# EAGLE design Main_module_v2 (EAGLE 9.1.1)
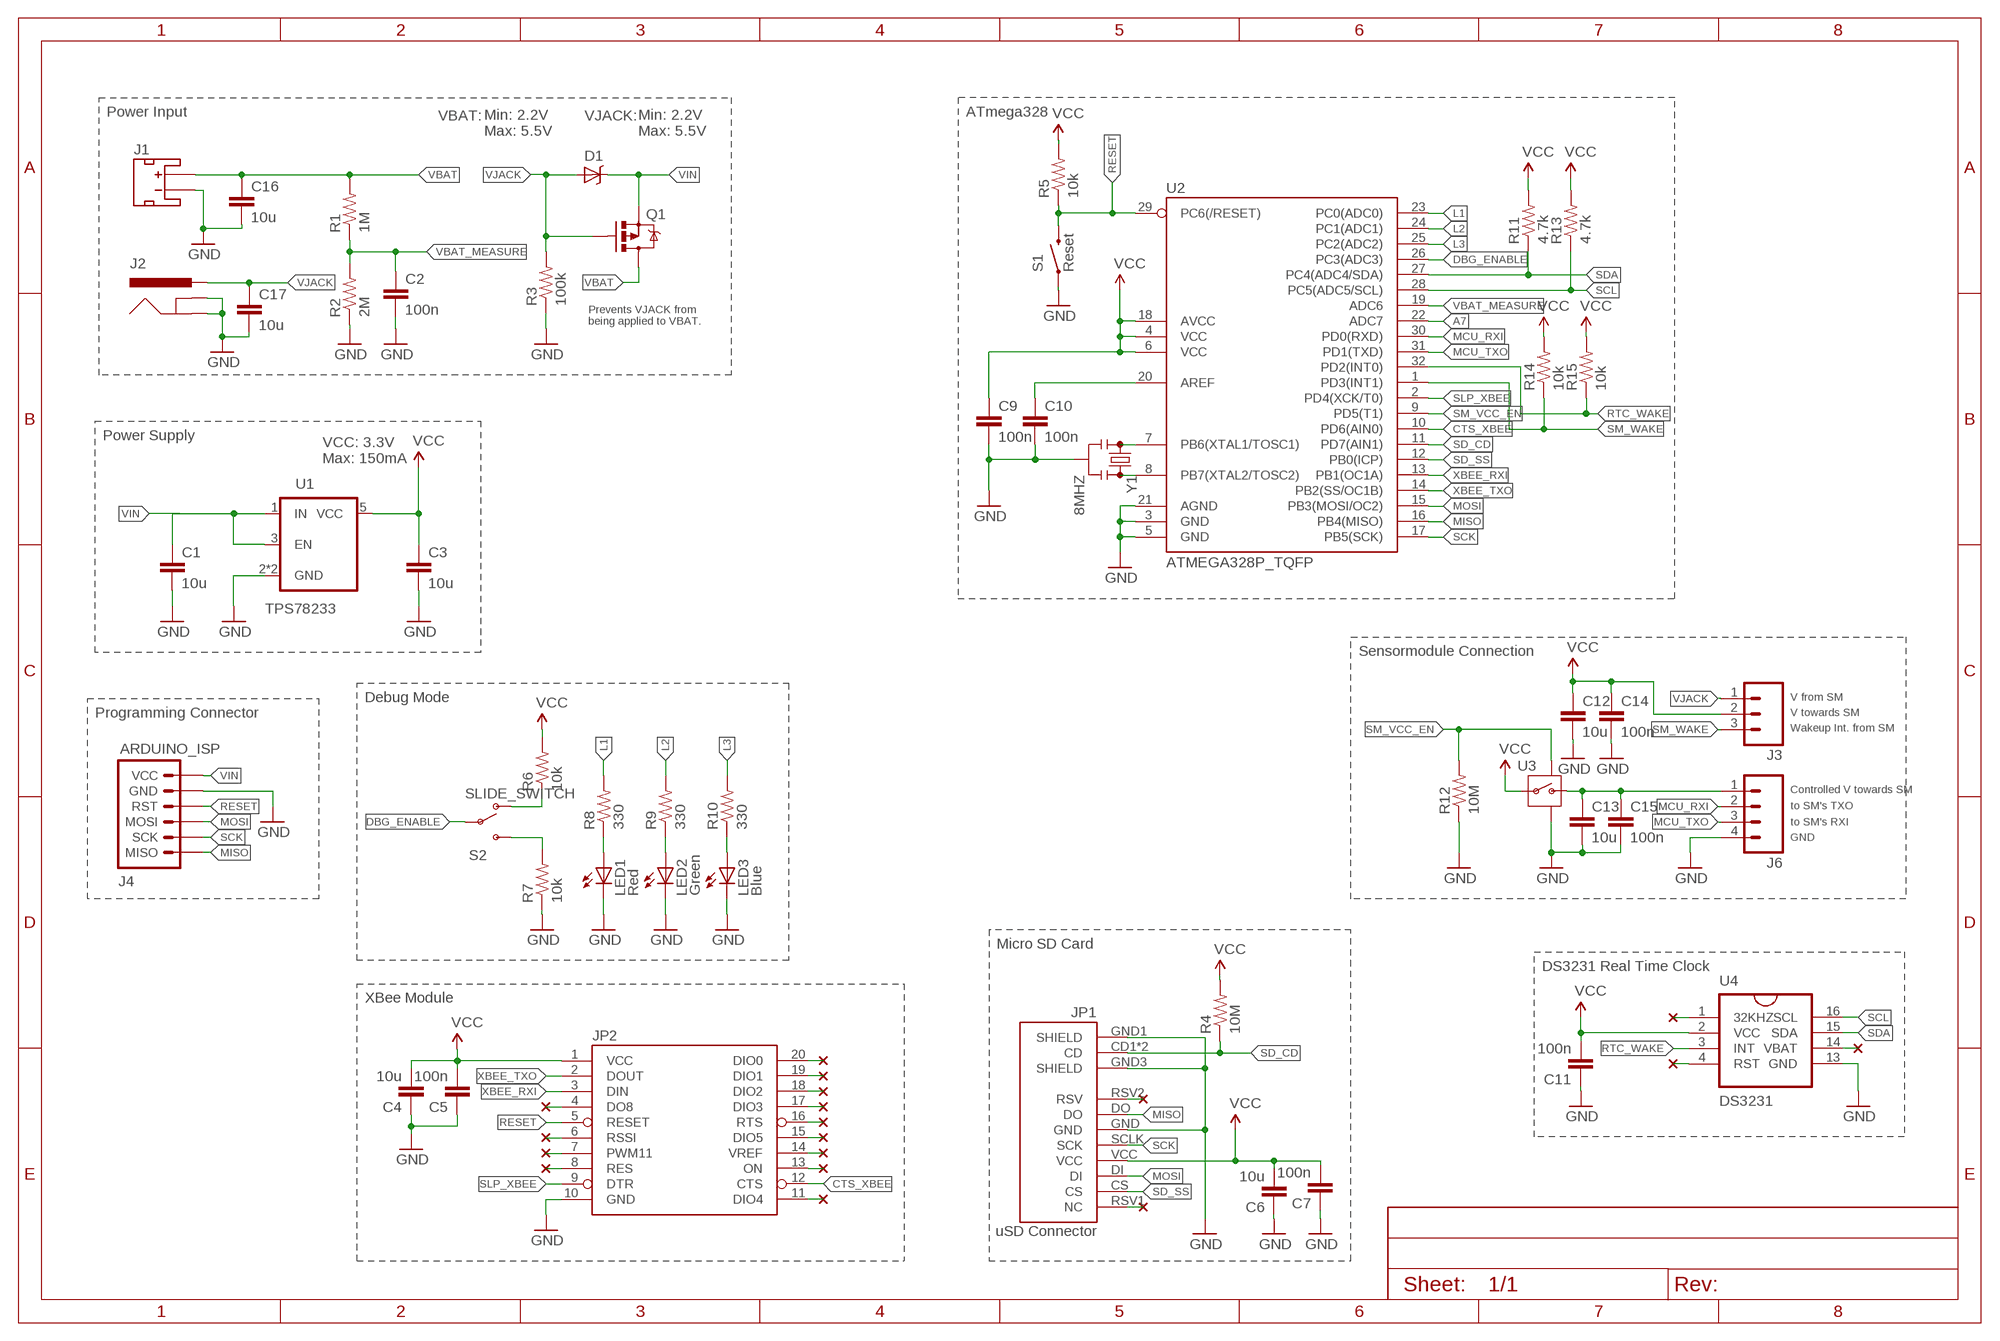
[diagram p0: schematic, sheet 1]
FRAME1 (FRAME-A4L): CNAME: Main Module; CREVISION: 2.0

## Parts
C1  10u  C  [C0805]
C2  100n  C  [C0805]
C3  10u  C  [C0805]
C4  10u  C  [C0805]
C5  100n  C  [C0805]
C6  10u  C  [C0805]
C7  100n  C  [C0805]
C9  100n  C  [C0805]
C10  100n  C  [C0805]
C11  100n  C  [C0805]
C12  10u  C  [C0805]
C13  10u  C  [C0805]
C14  100n  C  [C0805]
C15  100n  C  [C0805]
C16  10u  C  [C0805]
C17  10u  C  [C0805]
D1  DIODE-SCHOTTKY  [0603-DIODE]
J1  JST_2MM_MALE  [JST-2-SMD]
J2  5.5x2.1mm Barrel  POWER_JACKSMD  [POWER_JACK_SMD]
J3  M03PTH  [1X03]
J4  ARDUINO_ISP  [M-2X3]
J6  M04PTH  [1X04]
JP1  USD-SOCKETNEW  [MICRO-SD-SOCKET-PP]
JP2  XBEEB3  [XBEE-SMD]
LED1  Red  LEDSML0805  [SML0805]
LED2  Green  LEDSML0805  [SML0805]
LED3  Blue  LEDSML0805  [SML0805]
Q1  PFET  MOSFET-PCHANNELSMD  [SOT23-3]
R1  1M  RESISTOR0805-RES  [0805]
R2  2M  RESISTOR0805-RES  [0805]
R3  100k  RESISTOR0805-RES  [0805]
R4  10M  RESISTOR0805-RES  [0805]
R5  10k  RESISTOR0805-RES  [0805]
R6  10k  RESISTOR0805-RES  [0805]
R7  10k  RESISTOR0805-RES  [0805]
R8  330  RESISTOR0805-RES  [0805]
R9  330  RESISTOR0805-RES  [0805]
R10  330  RESISTOR0805-RES  [0805]
R11  4.7k  RESISTOR0805-RES  [0805]
R12  10M  RESISTOR0805-RES  [0805]
R13  4.7k  RESISTOR0805-RES  [0805]
R14  10k  RESISTOR0805-RES  [0805]
R15  10k  RESISTOR0805-RES  [0805]
S1  Reset  PUSHBUTTON  [M-PUSHBUTTON-SMD]
S2  SLIDE_SWITCH  [P-JS202011SCQN]
U1  TPS78233  [SOT23-5]
U2  ATMEGA328P_TQFP  [TQFP32-08]
U3  SIP32431  [SC70]
U4  DS3231SOIC16  [SO016]
Y1  8MHZ  RESONATOR8MHZ  [RESONATOR-SMD]

## Nets
A7: U2.22(ADC7)
CTS_XBEE: JP2.12(CTS) U2.10(PD6(AIN0))
DBG_ENABLE: S2.P$2(MIDDLE) S2.P$5(MIDDLE) U2.26(PC3(ADC3))
GND [GND]: C1.2 C2.2 C3.2 C4.1 C5.1 C6.1 C7.1 C9.2 C10.2 C11.1 C12.2 C13.2 C14.2 C15.2 C16.2 C17.2 J1.1(-) J2.GND(GNDBREAK) J2.P$4(GND) J4.P$5(GND) J6.4 JP1.GND JP1.GND1(SHIELD) JP1.GND3(SHIELD) JP2.10(GND) LED1.C LED2.C LED3.C R2.1 R3.1 R7.1 R12.1 S1.1(LEFT) S1.2(LEFT) U1.2(GND) U1.4(GND) U2.3(GND) U2.5(GND) U2.21(AGND) U3.2(GND) U3.5(GND) U3.6(GND) U4.13(GND) Y1.2
L1: R8.2 U2.23(PC0(ADC0))
L2: R9.2 U2.24(PC1(ADC1))
L3: R10.2 U2.25(PC2(ADC2))
MCU_RXI: J6.2 U2.30(PD0(RXD))
MCU_TXO: J6.3 U2.31(PD1(TXD))
MISO: J4.P$1(MISO) JP1.DO U2.16(PB4(MISO))
MOSI: J4.P$3(MOSI) JP1.DI U2.15(PB3(MOSI/OC2))
N$1: U2.8(PB7(XTAL2/TOSC2)) Y1.3
N$2: U2.7(PB6(XTAL1/TOSC1)) Y1.1
N$3: JP1.RSV1(NC)
N$4: U4.1(32KHZ)
N$5: LED3.A R10.1
N$6: JP2.4(DO8)
N$8: JP2.6(RSSI)
N$9: JP2.7(PWM11)
N$10: JP2.8(RES)
N$11: LED2.A R9.1
N$12: U4.4(RST)
N$13: JP2.11(DIO4)
N$14 [Vsupply]: C13.1 C15.1 J6.1 U3.1(OUT)
N$15: C10.1 U2.20(AREF)
N$16: JP2.14(VREF)
N$17: JP2.15(DIO5)
N$18: JP2.16(RTS)
N$19: JP2.17(DIO3)
N$20: JP2.18(DIO2)
N$21: JP2.19(DIO1)
N$22: JP2.20(DIO0)
N$23: JP1.RSV2(RSV)
N$24: JP2.13(ON)
N$30: LED1.A R8.1
N$31: U4.14(VBAT)
N$34: R7.2 S2.P$1(LOWER) S2.P$4(LOWER)
N$35: R6.1 S2.P$3(UPPER) S2.P$6(UPPER)
RESET: J4.P$4(RST) JP2.5(RESET) R5.1 S1.3(RIGHT) S1.4(RIGHT) U2.29(PC6(/RESET))
RTC_WAKE: R15.1 U2.32(PD2(INT0)) U4.3(INT)
SCK: J4.P$2(SCK) JP1.SCLK(SCK) U2.17(PB5(SCK))
SCL: R13.1 U2.28(PC5(ADC5/SCL)) U4.16(SCL)
SD_CD: JP1.CD1(CD) JP1.CD2(CD) R4.1 U2.11(PD7(AIN1))
SD_SS: JP1.CS U2.12(PB0(ICP))
SDA: R11.1 U2.27(PC4(ADC4/SDA)) U4.15(SDA)
SLP_XBEE: JP2.9(DTR) U2.2(PD4(XCK/T0))
SM_VCC_EN: R12.2 U2.9(PD5(T1)) U3.3(ON)
SM_WAKE: J3.3 R14.1 U2.1(PD3(INT1))
VBAT [Vsupply]: C16.1 J1.2(+) Q1.3(D) R1.2
VBAT_MEASURE: C2.1 R1.1 R2.2 U2.19(ADC6)
VCC [Vsupply]: C3.1 C4.2 C5.2 C6.2 C7.2 C9.1 C11.2 C12.1 C14.1 J3.2 JP1.VCC JP2.1(VCC) R4.2 R5.2 R6.2 R11.2 R13.2 R14.2 R15.2 U1.5(VCC) U2.4(VCC) U2.6(VCC) U2.18(AVCC) U3.4(IN) U4.2(VCC)
VIN [Vsupply]: C1.1 D1.C J4.P$6(VCC) Q1.2(S) U1.1(IN) U1.3(EN)
VJACK [Vsupply]: C17.1 D1.A J2.VIN0(PWR) J2.VIN1(PWR) J3.1 Q1.1(G) R3.2
XBEE_RXI: JP2.3(DIN) U2.13(PB1(OC1A))
XBEE_TXO: JP2.2(DOUT) U2.14(PB2(SS/OC1B))
Unconnected: J1.NC1(PAD1) J1.NC2(PAD2)

## Notes on the sheet
- Power Input | VBAT: | VJACK: | ATmega328
- Min: 2.2V
  Max: 5.5V
- Min: 2.2V
  Max: 5.5V
- Prevents VJACK from 
  being applied to VBAT.
- Power Supply
- VCC: 3.3V
  Max: 150mA
- Sensormodule Connection
- Debug Mode | V from SM
- Programming Connector | V towards SM
- Wakeup Int. from SM
- Controlled V towards SM
- to SM's TXO
- to SM's RXI
- GND
- Micro SD Card
- DS3231 Real Time Clock
- XBee Module

## Library data of the parts
C1-C7 C9-C17 = eagle-ltspice:C: CAPACITOR, European symbol; SPICEMODEL: NONE; SPICEPREFIX: C
D1 = Pinoccio:DIODE-SCHOTTKY
J1 = marc_library:JST_2MM_MALE: Mates to single-cell LiPo batteries. CONN-11443 Now with smashable polarity marks!; BTM_NEG: -; BTM_POS: +; PROD_ID: CONN-11443; TOP_NEG: -; TOP_POS: +
J2 = marc_library:POWER_JACK: Power Jack This is the standard 5.5mm barrel jack for power. The PTH is the most common, proven, reliable, footprint. The Slot footprint only works if the mill layer is transmitted to the PCB fab house so be warned. Mating wall wart : TOL-00298 (and others); PROD_ID: CONN-08106; SF_ID: PRT-12748
J3 = SparkFun-Connectors:M03: Header 3 Standard 3-pin 0.1" header. Use with straight break away headers (SKU : PRT-00116), right angle break away headers (PRT-00553), swiss pins (PRT-00743), machine pins (PRT-00117), and female headers (PRT-00115). Molex polarized connector foot print use with SKU : PRT-08232 with associated crimp pins and housings.
J4 = marc_library:ARDUINO_ISP: AVR ISP 6-pin inline header for Arduino ISP
J6 = SparkFun-Connectors:M04: Header 4 Standard 4-pin 0.1" header. Use with straight break away headers (SKU : PRT-00116), right angle break away headers (PRT-00553), swiss pins (PRT-00743), machine pins (PRT-00117), and female headers (PRT-00115). Molex polarized connector foot print use with SKU : PRT-08231 with associated crimp pins and housings. 1MM SMD Version SKU: PRT-10208; PROD_ID: CONN-09696
JP1 = marc_library:USD-SOCKET: microSD Socket Push-push type uSD socket. Schematic element and footprint production proven. Spark Fun Electronics SKU : PRT-00127. tDoc lines correctly indicate media card edge positions when inserting (unlocked, locked, depressed). NOTE: CD1 and CD2 are connected internally; PROD_ID: CONN-07820
JP2 = marc_library:XBEE: Xbee module footprints; PROD_ID: CONN-09042
LED1-LED3 = led:LED: LED OSRAM: - CHIPLED LG R971, LG N971, LY N971, LG Q971, LY Q971, LO R971, LY R971 LH N974, LH R974 LS Q976, LO Q976, LY Q976 LO Q996 - Hyper CHIPLED LW Q18S LB Q993, LB Q99A, LB R99A - SideLED LS A670, LO A670, LY A670, LG A670, LP A670 LB A673, LV A673, LT A673, LW A673 LH A674 LY A675 LS A676, LA A676, LO A676, LY A676, LW A676 LS A679, LY A679, LG A679 - Hyper Micro SIDELED® LS Y876, LA Y876, LO Y876, LY Y876 LT Y87S - SmartLED LW L88C, LW L88S LB L89C, LB L89S, LG L890 LS L89K, LO L89K, LY L89K LS L896, LA L896, LO L896, LY L896 - TOPLED LS T670, LO T670, LY T670, LG T670, LP T670 LSG T670, LSP T670, LSY T670, LOP T670, LYG T670 LG T671, LOG T671, LSG T671 LB T673, LV T673, LT T673, LW T673 LH T674 LS T676, LA T676, LO T676, LY T676, LB T676, LH T676, LSB T676, LW T676 LB T67C, LV T67C, LT T67C, LS T67K, LO T67K, LY T67K, LW E67C LS E67B, LA E67B, LO E67B, LY E67B, LB E67C, LV E67C, LT E67C LW T67C LS T679, LY T679, LG T679 LS T770, LO T770, LY T770, LG T770, LP T770 LB T773, LV T773, LT T773, LW T773 LH T774 LS E675, LA E675, LY E675, LS T675 LS T776, LA T776, LO T776, LY T776, LB T776 LHGB T686 LT T68C, LB T68C - Hyper Mini TOPLED® LB M676 - Mini TOPLED Santana® LG M470 LS M47K, LO M47K, LY M47K Source: http://www.osram.convergy.de LUXEON: - LUMILED® LXK2-PW12-R00, LXK2-PW12-S00, LXK2-PW14-U00, LXK2-PW14-V00 LXK2-PM12-R00, LXK2-PM12-S00, LXK2-PM14-U00 LXK2-PE12-Q00, LXK2-PE12-R00, LXK2-PE12-S00, LXK2-PE14-T00, LXK2-PE14-U00 LXK2-PB12-K00, LXK2-PB12-L00, LXK2-PB12-M00, LXK2-PB14-N00, LXK2-PB14-P00, LXK2-PB14-Q00 LXK2-PR12-L00, LXK2-PR12-M00, LXK2-PR14-Q00, LXK2-PR14-R00 LXK2-PD12-Q00, LXK2-PD12-R00, LXK2-PD12-S00 LXK2-PH12-R00, LXK2-PH12-S00 LXK2-PL12-P00, LXK2-PL12-Q00, LXK2-PL12-R00 Source: www.luxeon.com KINGBRIGHT: KA-3528ASYC Source: www.kingbright.com
Q1 = Pinoccio:MOSFET-PCHANNEL
R1-R15 = SparkFun-Passives:RESISTOR: Resistor Basic schematic elements and footprints for 0603, 1206, and PTH resistors.
S1 = marc_library:PUSHBUTTON
S2 = marc_library:SLIDE_SWITCH: SWCH-10651 Side-actuated SPDT slide switch, as used on the Arduino Pro
U1 = marc_library:TPS78233: Voltage Regulator LDO 500nA Ground Current, 150mA, Ultra-Low Quiescent Current Low-Dropout Linear Regulator.
U2 = marc_library:ATMEGA328P_TQFP; PROD_ID: IC-09069
U3 = marc_library:SIP32431
U4 = marc_library:DS3231: RS232 Transceiver Very common IC. This is generically called 'MAX232', but works with the 3V equivalent MAX3232 generic ICs. Field tested and mother approved. Spark Fun Electronics SKU : COM-00316 (DIP) and COM-00589 (SMD); PROD_ID: IC-08171
Y1 = marc_library:RESONATOR: Resonator Small SMD resonator. Used, eg, on the Arduino Pro/ Pro Mini boards. 8MHz- XTAL-08895 16MHz- XTAL-08900; PROD_ID: XTAL-08895

## Net classes
0 default: width 0.3 mm
1 Vsupply: width 0.5 mm
5 GND: width 0.5 mm

## Board
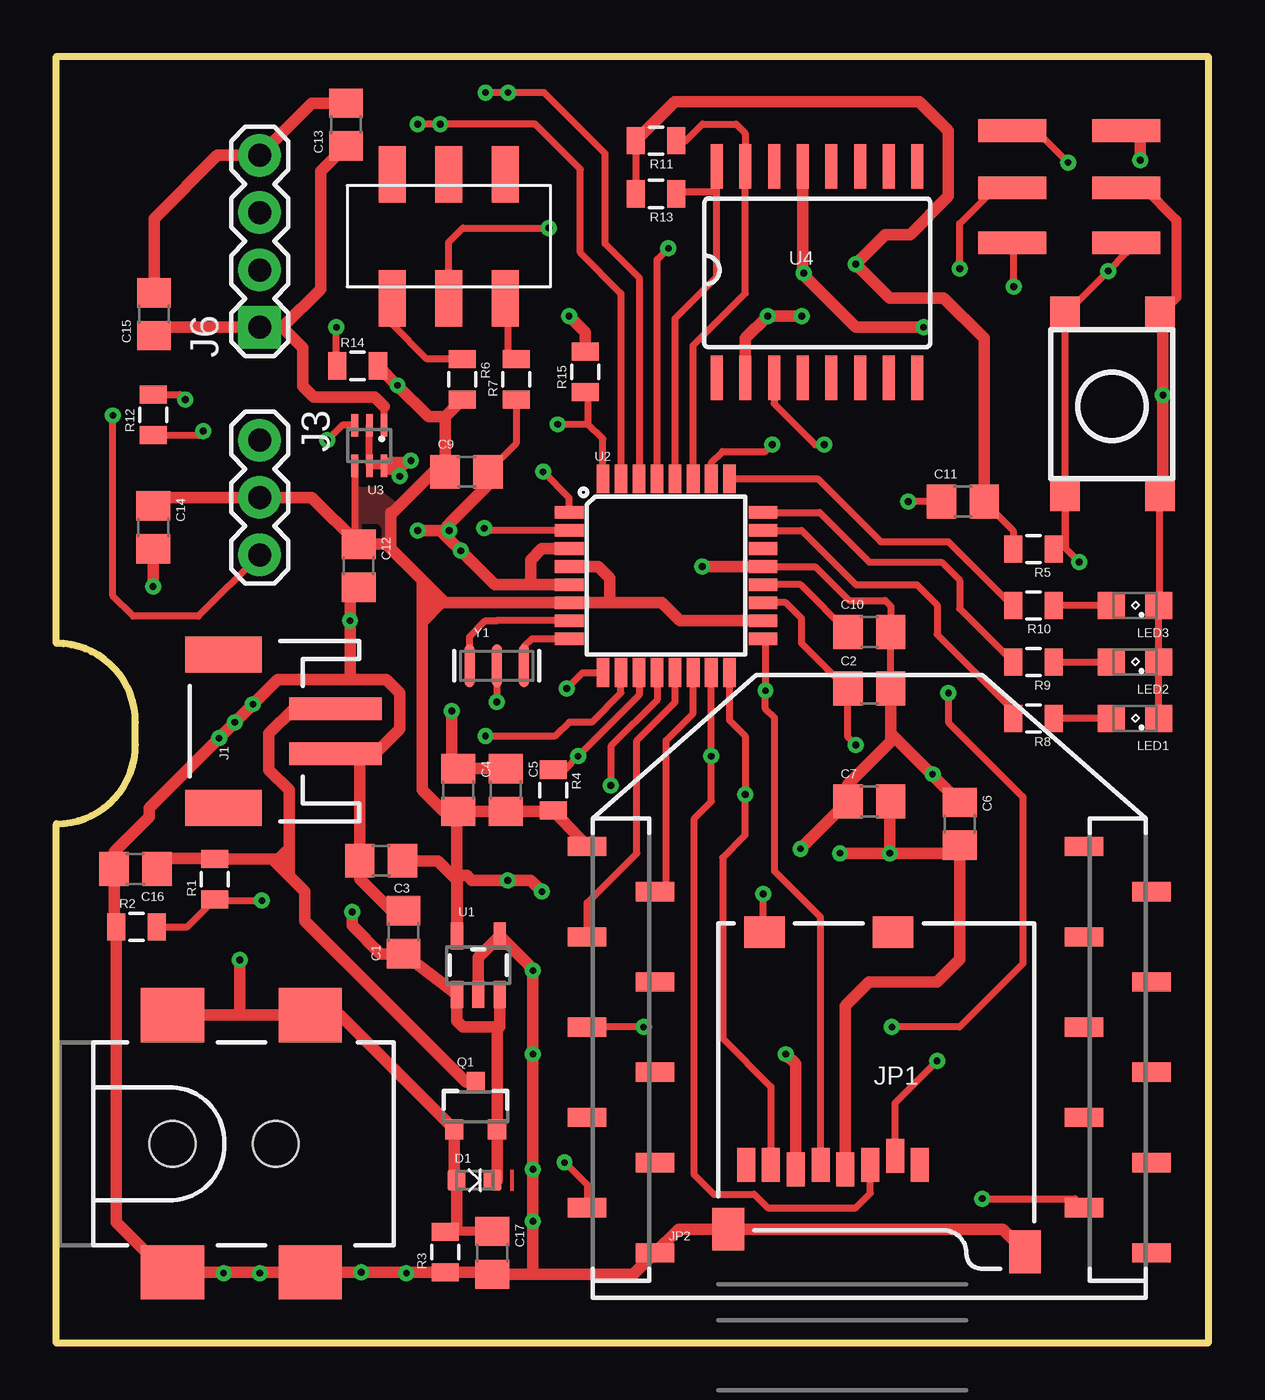
[diagram p1: board, top side]
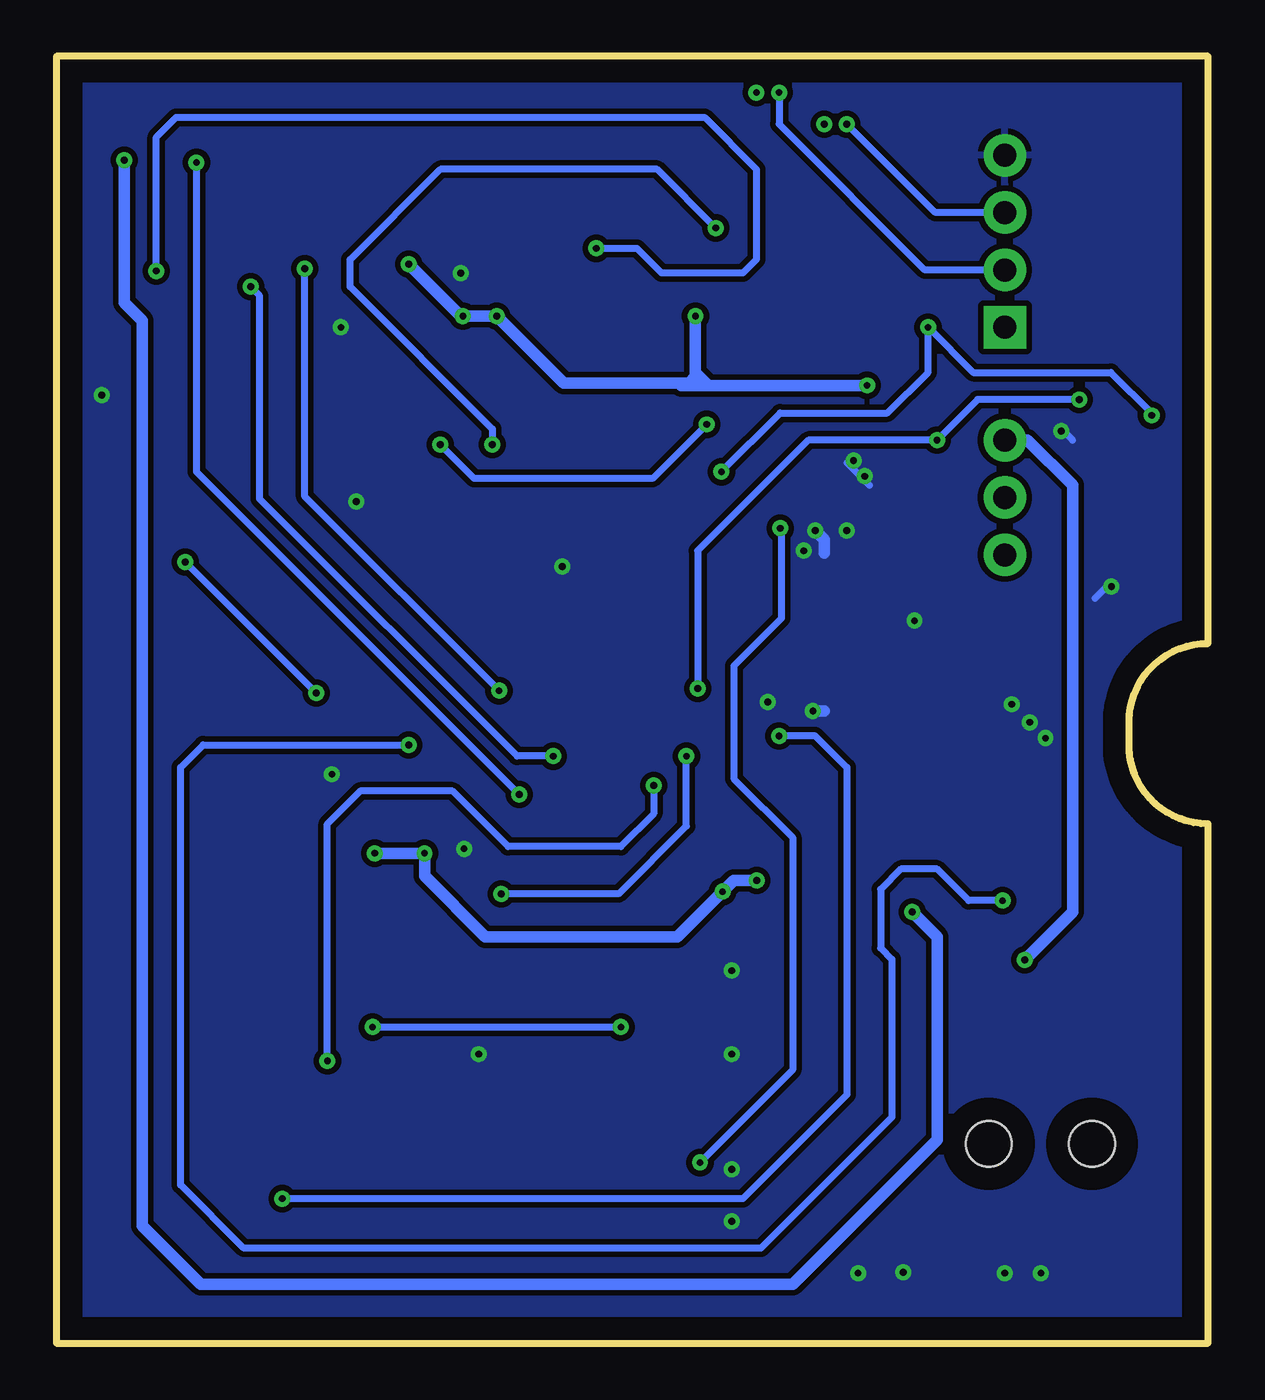
[diagram p2: board, bottom side, seen from below]

Size 51 x 57 mm. Coordinates in mm from the lower left corner, seen from the top.
Outline: 0,31 0,57 51,57 51,0 0,0 0,23 arc90 3.5,26.5 3.5,27.5 arc90 0,31
Copper layers (1*16): Top 0.035mm / dielectric 1.5mm / Bottom 0.035mm
Design rules "default *": minimum track width 0.15mm, minimum drill 0.3mm, track to track 6mil, track to pad 6mil, pad to pad 6mil, via to via 6mil, smd to smd 6mil, copper to edge 40mil, drill to drill 10mil, minimum pad ring 10mil, minimum via ring 8mil, stop-mask expansion 4mil, vias tented up to drill 0mil, thermal gap 10mil

### Footprints (pad centres in the part's own frame; a part is rotated, then mirrored left to right if it is on the bottom)
C0805 = smd 1.3 x 1.5: 1 -0.95,0; 2 0.95,0
0603-DIODE = smd 0.8 x 0.95: A -0.8,0; C 0.8,0
JST-2-SMD = smd 1 x 4.1: 1 -1,-3.45; 2 1,-3.45 | smd 1.6 x 3.4: NC1 -3.4,1.5; NC2 3.4,1.5
POWER_JACK_SMD = smd 2.8 x 2.4: GND 0,-5.7; P$4 6.1,-5.7; VIN0 0,5.7; VIN1 6.1,5.7 | hole 2.032: 0,0; 4.572,0
1X03 = drill 1.016 pad 1.88: 1 0,0; 2 2.54,0; 3 5.08,0
M-2X3 = smd 1 x 3: P$1 0,0; P$2 2.54,0; P$3 4.98,0; P$4 4.98,5.05; P$5 2.54,5.05; P$6 0,5.05
1X04 = drill 1.016 pad 1.88 square: 1 0,0 | drill 1.016 pad 1.88: 2 2.54,0; 3 5.08,0; 4 7.62,0
MICRO-SD-SOCKET-PP = smd 1.8 x 1.4: CD1 -2.05,0.4; CD2 -7.75,0.4 | smd 0.8 x 1.5: CS -7.84,10.3; DI -6.74,10.7; DO -2.34,10.7; GND -3.44,10.9; RSV1 -8.94,10.7; RSV2 -1.24,10.7; SCLK -4.54,10.7; VCC -5.64,10.9 | smd 1.4 x 1.9: GND1 -13.6,14.55; GND3 -0.45,13.55
XBEE-SMD = smd 1.7 x 0.85: 1 -12.5,20; 2 -9.5,18; 3 -12.5,16; 4 -9.5,14; 5 -12.5,12; 6 -9.5,10; 7 -12.5,8; 8 -9.5,6; 9 -12.5,4; 10 -9.5,2; 11 12.5,2; 12 9.5,4; 13 12.5,6; 14 9.5,8; 15 12.5,10; 16 9.5,12; 17 12.5,14; 18 9.5,16; 19 12.5,18; 20 9.5,20
SML0805 = smd 1.2 x 1.2: A 1.05,0; C -1.05,0
SOT23-3 = smd 0.8 x 0.9: 1 -0.95,-1; 2 0.95,-1; 3 0,1.1
0805 = smd 0.8 x 1.2: 1 -0.9,0; 2 0.9,0
M-PUSHBUTTON-SMD = smd 1.55 x 1.3: 1 0,0; 2 7.95,0; 3 0,-4.2; 4 7.95,-4.2
P-JS202011SCQN = smd 1.2 x 2.5: P$1 0,0; P$2 2.5,0; P$3 5,0; P$4 0,5.5; P$5 2.5,5.5; P$6 5,5.5
SOT23-5 = smd 0.55 x 1.2: 1 -0.95,-1.3; 2 0,-1.3; 3 0.95,-1.3; 4 0.95,1.3; 5 -0.95,1.3
TQFP32-08 = smd 1.27 x 0.559: 1 -4.293,2.8; 2 -4.293,2; 3 -4.293,1.2; 4 -4.293,0.4; 5 -4.293,-0.4; 6 -4.293,-1.2; 7 -4.293,-2; 8 -4.293,-2.8; 17 4.293,-2.8; 18 4.293,-2; 19 4.293,-1.2; 20 4.293,-0.4; 21 4.293,0.4; 22 4.293,1.2; 23 4.293,2; 24 4.293,2.8 | smd 0.559 x 1.27: 9 -2.8,-4.293; 10 -2,-4.293; 11 -1.2,-4.293; 12 -0.4,-4.293; 13 0.4,-4.293; 14 1.2,-4.293; 15 2,-4.293; 16 2.8,-4.293; 25 2.8,4.293; 26 2,4.293; 27 1.2,4.293; 28 0.4,4.293; 29 -0.4,4.293; 30 -1.2,4.293; 31 -2,4.293; 32 -2.8,4.293
SC70 = smd 0.3 x 1: 1 0,0; 2 0.65,0; 3 1.3,0; 4 1.3,1.8; 5 0.65,1.8; 6 0,1.8
SO016 = smd 0.53 x 1.98: 1 0,0; 2 1.27,0; 3 2.54,0; 4 3.81,0; 5 5.08,0; 6 6.35,0; 7 7.62,0; 8 8.89,0; 9 8.89,9.37; 10 7.62,9.37; 11 6.35,9.37; 12 5.08,9.37; 13 3.81,9.37; 14 2.54,9.37; 15 1.27,9.37; 16 0,9.37
RESONATOR-SMD = smd 0.45 x 1.905: 1 -1.2,0; 2 0,0; 3 1.2,0

### Placement (x,y rotation side)
C1  15.37,18.2 90 top
C2  36,29 0 top
C3  14.38,21.37 180 top
C4  17.8,24.5 270 top
C5  19.9,24.5 270 top
C6  40,23 270 top
C7  36,24 0 top
C9  18.16,38.6 0 top
C10  36,31.5 0 top
C11  40.14,37.28 0 top
C12  13.38,34.44 270 top
C13  12.82,53.98 90 top
C14  4.28,36.14 270 top
C15  4.32,45.58 90 top
C16  3.5,21 180 top
C17  19.3,4 270 top
D1  18.52,7.22 0 top
J1  8.9,27.1 90 top
J2  5.14,8.83 0 top
J3  9,40 270 top
J4  42.33,53.71 270 top
J6  9,45 90 top
JP1  29.3,18.6 180 top
JP2  36,2 0 top
LED1  47.77,27.67 180 top
LED2  47.77,30.17 180 top
LED3  47.77,32.67 180 top
Q1  18.56,10.47 0 top
R1  7.01,20.55 90 top
R2  3.54,18.44 0 top
R3  17.21,4.03 90 top
R4  22,24.5 270 top
R5  43.27,35.17 180 top
R6  17.97,42.7 270 top
R7  20.36,42.69 90 top
R8  43.27,27.67 180 top
R9  43.27,30.17 180 top
R10  43.27,32.67 180 top
R11  26.55,53.26 180 top
R12  4.28,41.12 90 top
R13  26.55,50.91 180 top
R14  13.34,43.29 0 top
R15  23.41,43.03 90 top
S1  48.87,45.59 270 top
S2  19.87,51.78 180 top
U1  18.68,16.74 0 top
U2  27,34 0 top
U3  14.51,40.66 180 top
U4  29.24,42.76 0 top
Y1  19.5,30 0 top

### Tracks (layer width: path | path; a pad name or v marks a point on that pad's centre or on a via)
CTS_XBEE  (via drill 0.3)
  Top 0.3: U2.10 25,28.8 23.7,27.5 22.7,27.5 22.1,26.9 v19,26.9 | 45.3,6 JP2.12 45.1,6.4 v41,6.4
  Bottom 0.3: v41,6.4 20.6,6.4 16,11 16,25.5 17.4,26.9 v19,26.9
DBG_ENABLE  (via drill 0.3)
  Top 0.3: U2.26 29,39 29.5,39.5 31.4,39.5 v31.7,39.8 | S2.P$5 17.37,48.77 18,49.4 v21.8,49.4
  Bottom 0.3: v31.7,39.8 31.7,40.5 38,46.8 38,48 34,52 24.4,52 v21.8,49.4
GND  (via drill 0.3)
  Top 0.3: U2.3 | J4.P$5 arc90 48.15,51.2 | 48.87,45.67 S1.1 | Y1.2 v19.5,28.4 | C2.2 C10.2 36.95,32.65 36.7,32.9 35.1,32.9 33.6,34.4 U2.21 | C11.1 v37.72,37.28 | LED1.C LED2.C LED3.C | 48.87,32.67 S1.2 | R7.1 20.36,39.85 C9.2 19.11,38.01 | v17.4,36 v16,36 17,36 | C4.1 17.55,25.45 | 13.43,25.57 arc90 13,26 12.7,26 | R12.1 6.32,40.22 v6.5,40.4 | C12.2 13,33.27 | U3.2 U3.5 U3.6 | U3.6 14.64,38.86 v15.2,38.4 | U3.6 15.46,38.86 v15.7,39.1 | v15.2,38.4 15.1,38.5 v15.7,39.1 | v15.7,39.1 14.9,39.1 | 14.6,39.1 14.9,39.1 | 14.9,39.1 15,39 | v15.2,38.4 14.9,38.6 14.6,38.6
  Top 0.406: LED3.C 48.87,32.67 | S1.2 49,37.64
  Top 0.45: 48.15,51.2 49.6,49.75 49.6,46.32 S1.1
  Top 0.5: U1.2 18.68,17.09 U1.4 21.1,16.57 v21.1,16.5 v21.1,12.8 v21.1,7.7 v21.1,5.4 21.1,3.05 | U2.5 21,33.6 | U2.3 21.5,35.2 21,34.7 21,33.6 | U2.21 v28.6,34.4 | S1.1 49,45.59 v49,42 49,37.64 | J2.GND J2.P$4 v13.5,3.13 R3.1 19.22,3.13 C17.2 21.1,3.05 | 21.1,3.05 25.55,3.05 JP2.10 27.55,5.05 JP1.GND3 41.9,5.05 JP1.GND1 | JP1.GND 32.74,12.36 v32.3,12.8 | C4.1 C5.1 | C1.2 14.85,19.15 13.43,20.57 C3.2 13.43,25.57 | 5,3 2.64,5.36 R2.1 2.55,18.53 C16.2 2.55,21.75 4.1,23.3 4.1,23.7 v7.2,26.8 v7.9,27.5 v8.7,28.3 9.8,29.4 13,29.4 | C6.1 36.95,27 C2.2 36.95,26.65 35.05,24.75 C7.1 v32.95,21.9 | v38.4,45 35.4,45 33.05,47.35 U4.13 | 21,33.6 19.4,33.6 v17.9,35.1 17.4,35.6 | 17.4,35.6 v17.4,36 17.4,36.3 | 17.4,36.3 19.11,38.01 | 17,36 17.4,35.6 | v16,36 17.1,36 17.4,36.3 | 12.7,26 arc-90 J1.1 14.1,26.1 15.2,27.2 15.2,28.8 14.6,29.4 13,29.4 | 17.55,25.45 17.5,25.5 v17.5,28 | C15.2 4.32,49.82 7.12,52.62 J6.4 11.31,54.93 C13.2 | C14.2 v4.28,33.52 | 13,33.27 v13,32 13,29.4
  Bottom 0.3: v4.28,33.52 4.48,33.52 5,33 | v6.5,40.4 6.4,40.4 6,40 | v15.2,38.4 15.4,38.4 | 15.4,38.4 15.7,38.7 | v15.7,39.1 15.7,38.7 | 15.4,38.4 15,38 | 15.7,38.7 16,39
  Bottom 0.5: v17.5,28 17,28 | v17.4,36 17,35.6 17,35
  other vias: 38.8,25.2 7.4,3.1 9,3.1 15.5,3.1 33.1,47.4
  pour Bottom (isolate 0.25, rank 6): 51,57 0,57 0,0 51,0
L1
  Top 0.3: U2.23 33,36 35.4,33.6 38.1,33.6 39,32.7 39,31.4 42.37,28.03 R8.2
L2
  Top 0.3: U2.24 33.8,36.8 36,34.6 39.2,34.6 40,33.8 40,32.54 R9.2
L3
  Top 0.3: U2.25 33.71,38.29 36.5,35.5 39.5,35.5 42.33,32.67 R10.2
MCU_RXI  (via drill 0.3)
  Top 0.3: U2.30 25.8,47.2 24.3,48.7 24.3,52.7 21.6,55.4 v20,55.4 v19,55.4
  Bottom 0.3: v19,55.4 19,54 12.54,47.54 J6.2
MCU_TXO  (via drill 0.3)
  Top 0.3: U2.31 25,46.5 23.2,48.3 23.2,52 21.2,54 v17,54 v16,54
  Bottom 0.3: J6.3 12.08,50.08 v16,54
MISO  (via drill 0.3)
  Top 0.3: JP1.DO 31.64,11.36 29.5,13.5 29.5,21.5 30.5,22.5 v30.5,24.3 30.5,26.9 29.8,27.6 U2.16 | 42.04,54 arc-90 J4.P$1 43.39,53.71 v44.8,52.3
  Bottom 0.3: v30.5,24.3 43.6,37.4 44,37.8 44.8,38.6 v44.8,52.3
MOSI  (via drill 0.3)
  Top 0.3: U2.15 v29,26 29,24 28.25,23.25 28.25,7.45 29.1,6.6 30.9,6.6 31.5,6 35.4,6 36.04,6.64 JP1.DI | v42.4,46.8 42.4,48.73 J4.P$3
  Bottom 0.3: v29,26 30.6,26 42,37.4 42,46.4 v42.4,46.8
N$1
  Top 0.3: U2.8 21.05,31.2 20.7,30.85 Y1.3
N$2
  Top 0.3: U2.7 19.5,32 19,32 18.3,31.3 Y1.1
N$5
  Top 0.3: LED3.A R10.1
N$11
  Top 0.3: R9.1 LED2.A
N$14
  Top 0.3: U3.1 14.51,41.49
  Top 0.5: C15.1 4.69,45 J6.1 10,45 | 10,45 11.7,46.7 11.7,51.91 C13.1 | 14.51,41.49 14.1,41.9 11.4,41.9 10.9,42.4 10.9,44.1 10,45
N$15
  Top 0.3: U2.20 32.95,33.6 C10.1
N$30
  Top 0.3: LED1.A R8.1
N$34
  Top 0.3: 20,46.4 20,47.15 S2.P$4 19.87,46.13 20,46 20,43.95 R7.2
N$35
  Top 0.3: R6.1 16.4,43.6 14.87,45.13 S2.P$6
RESET  (via drill 0.3)
  Top 0.3: R5.1 44.67,35.67 S1.4 | S1.4 S1.3 v46.58,47.5 47.38,48.3 J4.P$4 47.91,48.83 | S1.4 44.67,35.23 v45.3,34.6 | v39.5,28.8 39.5,27.5 42.8,24.2 42.8,16.8 40,14 v37,14 | v26,14 JP2.5 | U2.29 26.6,48 v27.1,48.5
  Bottom 0.3: v46.58,47.5 46.58,53.42 45.7,54.3 22.3,54.3 20,52 20,48 20.6,47.4 24.2,47.4 25.3,48.5 v27.1,48.5 | v45.3,34.6 v39.5,28.8 | v37,14 v26,14
RTC_WAKE  (via drill 0.3)
  Top 0.3: 23.56,40.7 v22.2,40.7 | U2.32 24.2,40.06 23.56,40.7 | 23.56,40.7 23.56,41.98 R15.1 | U4.3 31.78,41.62 33.6,39.8 v34,39.8
  Bottom 0.3: v22.2,40.7 24.6,38.3 32.5,38.3 v34,39.8
SCK  (via drill 0.3)
  Top 0.3: U2.17 arc-90 31.4,31.09 v31.4,28.9 31.4,28.1 31.8,27.7 31.8,20.9 33.84,18.86 JP1.SCLK | J4.P$2 41.57,51.17 40,49.6 v40,47.6
  Bottom 0.3: v31.4,28.9 40,37.5 v40,47.6
SCL
  Top 0.3: U2.28 27.4,45.4 29.24,47.24 29.24,51 | 29.24,51 U4.16 | R13.1 27.54,51 29.24,51
SD_CD  (via drill 0.3)
  Top 0.3: JP1.CD1 31.3,18.25 v31.3,19.9 | U2.11 25.8,28.7 v23.1,26 22.5,25.4 R4.1
  Bottom 0.3: v23.1,26 23.1,22.9 26.1,19.9 v31.3,19.9
SD_SS  (via drill 0.3)
  Top 0.3: U2.12 26.6,28.5 24.55,26.45 v24.55,24.7 | JP1.CS 37.14,10.64 v39,12.5
  Bottom 0.3: v24.55,24.7 24.55,23.45 26,22 31,22 33.45,24.45 37.55,24.45 39,23 v39,12.5
SDA
  Top 0.3: U2.27 28.2,44.2 30.51,46.51 U4.15 30.5,53.6 30.1,54 28.6,54 27.86,53.26 R11.1
SLP_XBEE  (via drill 0.3)
  Top 0.3: U2.2 19.05,36 v18.95,36.1 | v22.5,8 23.5,7 JP2.9
  Bottom 0.3: v22.5,8 18.4,12.1 18.4,22.4 21,25 21,30 18.9,32.1 18.9,36.05 arc-90 v18.95,36.1
SM_VCC_EN  (via drill 0.3)
  Top 0.3: v22.6,29 23.31,29.71 U2.9 | U3.3 12.66,40.66 v12,40 | R12.2 5.48,42.02 v5.7,41.8
  Bottom 0.3: v22.6,29 22.6,35.1 17.7,40 v12,40 10.2,41.8 v5.7,41.8
SM_WAKE  (via drill 0.3)
  Top 0.3: U2.1 22.71,37.44 v21.55,38.6 | R14.1 12.4,43.33 v12.4,45 | J3.3 6.28,32.2 3.4,32.2 2.5,33.1 v2.5,41.1
  Bottom 0.3: v21.55,38.6 18.95,41.2 14.2,41.2 12.4,43 v12.4,45 10.4,43 4.3,43 2.5,41.2 v2.5,41.1
VBAT
  Top 0.3: C16.1 4.91,21.46 | R1.2
  Top 0.5: R1.2 4.91,21.46 | Q1.3 18.13,11.57 11,18.7 11,20 10.3,20.7 | 10.3,20.7 9.55,21.45 | 9.55,21.45 R1.2 | J1.2 10.5,28.1 9.4,27 9.4,25.4 10.3,24.5 10.3,20.7 | 9.55,21.45 9.85,21.45 10.2,21.8
VBAT_MEASURE  (via drill 0.3)
  Top 0.3: R2.2 5.8,18.44 R1.1 7.06,19.6 v9.1,19.6 | U2.19 32.3,32.8 33,32.1 33,31 35,29 C2.1 35.05,26.85 v35.4,26.5
  Bottom 0.3: v9.1,19.6 10.6,19.6 12,21 13.6,21 14.5,20.1 14.5,17.5 14,17 14,10 19.8,4.2 42.7,4.2 45.5,7 45.5,25.5 44.5,26.5 v35.4,26.5
VCC  (via drill 0.3)
  Top 0.3: 17.75,18.06 U1.5 | 23.24,43.76 R15.2 | 36.9,23.95 C7.2 | C11.2 42.37,36 R5.2 | R11.2 R13.2 | C14.1 4.65,37.46 | 17.2,32.8 16.2,31.8 16.2,31.1 | U3.4 13.21,35.56 C12.1
  Top 0.5: C3.1 16.88,21.37 17.75,20.5 17.75,18.06 | 24.5,32.8 U2.6 17.2,32.8 17,33 | 24.5,32.8 26.8,32.8 27.6,32 U2.18 | U2.4 24,34.4 24.5,33.9 24.5,32.8 | 17.73,20.71 U1.5 | 23.75,22 JP2.1 R4.2 21.95,23.55 C5.2 C4.2 | 17.73,20.71 18.19,20.71 18.4,20.5 v19.99,20.5 21,20.5 v21.5,20 | v36.9,21.7 36.9,23.95 | v36.9,21.7 v34.7,21.7 | 17.73,20.71 17.73,23.48 C4.2 | v36.9,21.7 39.65,21.7 C6.2 40,17 39,16 36,16 34.94,14.94 JP1.VCC | 17,33 16.2,33.8 | 16.2,33.8 14.8,35.2 | 14.8,35.2 14.8,36.8 14.9,36.8 16.7,38.6 C9.1 17.21,41.04 | R6.2 17.21,41.04 | R14.2 v15.1,42.43 16.49,41.04 17.21,41.04 | C4.2 17.15,23.55 16.2,24.5 16.2,31.1 16.2,32.2 | 16.2,32.2 17,33 | 16.2,32.2 16.2,33.8 | 17,33 16.5,33 16.4,32.9 | C11.2 41.09,44.51 39.3,46.3 36.9,46.3 v35.4,47.8 36.7,49.1 37.8,49.1 39.5,50.8 39.5,53.7 38.2,55 27.39,55 R11.2 | U4.2 30.51,44.51 v31.5,45.5 v33,45.5 | R15.2 23.41,44.79 v22.7,45.5 | 4.65,37.46 J3.2 11.31,37.46 C12.1 14.61,35.39 14.8,35.2
  Bottom 0.3: 23.33,42.43 23.5,42.6
  Bottom 0.5: v19.99,20.5 21,20.5 v21.5,20 23.5,18 32,18 34.7,20.7 v34.7,21.7 v36.9,21.7 | v35.4,47.8 33.1,45.5 v33,45.5 v31.5,45.5 28.53,42.53 23,42.53 22.7,42.83 22.7,43 | v22.7,45.5 22.7,43 | v15.1,42.43 22.13,42.43 | 22.13,42.43 22.7,43 | 22.13,42.43 23.33,42.43
  pour Top: 13.3,35.4 13.3,37.8 14.1,37.8 15,37.1 15,37 14.8,36.8 14.8,35.8 14.4,35.4
VIN  (via drill 0.3)
  Top 0.3: 19.51,7.22 D1.C | J4.P$6 arc-90 48,53.89
  Top 0.5: 19.63,14 U1.3 | 19.63,14 18,14 17.73,14.27 U1.1 C1.1 14.35,17.25 13.1,18.5 v13.1,19.1 | 19.51,7.22 Q1.2 19.51,13.88 19.63,14 | v48,52.4 48,53.89
  Bottom 0.5: v13.1,19.1 12,18 12,9 18.4,2.6 44.6,2.6 47.2,5.2 47.2,45.3 48,46.1 v48,52.4
VJACK  (via drill 0.3)
  Top 0.3: 17.72,5.24 R3.2 | 17.61,7.22 D1.A | 12.55,14.53 J2.VIN1
  Top 0.406: C17.1 17.21,4.95 R3.2
  Top 0.5: D1.A 17.72,5.24 | 17.61,7.22 Q1.1 12.55,14.53 | J2.VIN0 8.12,14.53 | 8.12,14.53 J2.VIN1 | 8.12,14.53 v8.12,16.98
  Bottom 0.5: v8.12,16.98 6,19.1 6,38 8,40 J3.1
XBEE_RXI
  Top 0.3: JP2.3 23.5,19.5 25.7,21.7 25.7,26.7 27.4,28.4 U2.13
XBEE_TXO
  Top 0.3: JP2.2 27,20 27,26.7 28.2,27.9 U2.14
(copper drawn outside any net)
  shapes: Top area x1